# EasyEDA schematic SCH_Hacker-Card_2024-03-24.json
TITLE: Sheet_1; REV: 1.0; Date: 2024-03-18; Sheet: 1/1; Drawn By: swamstick; Company: Your Company
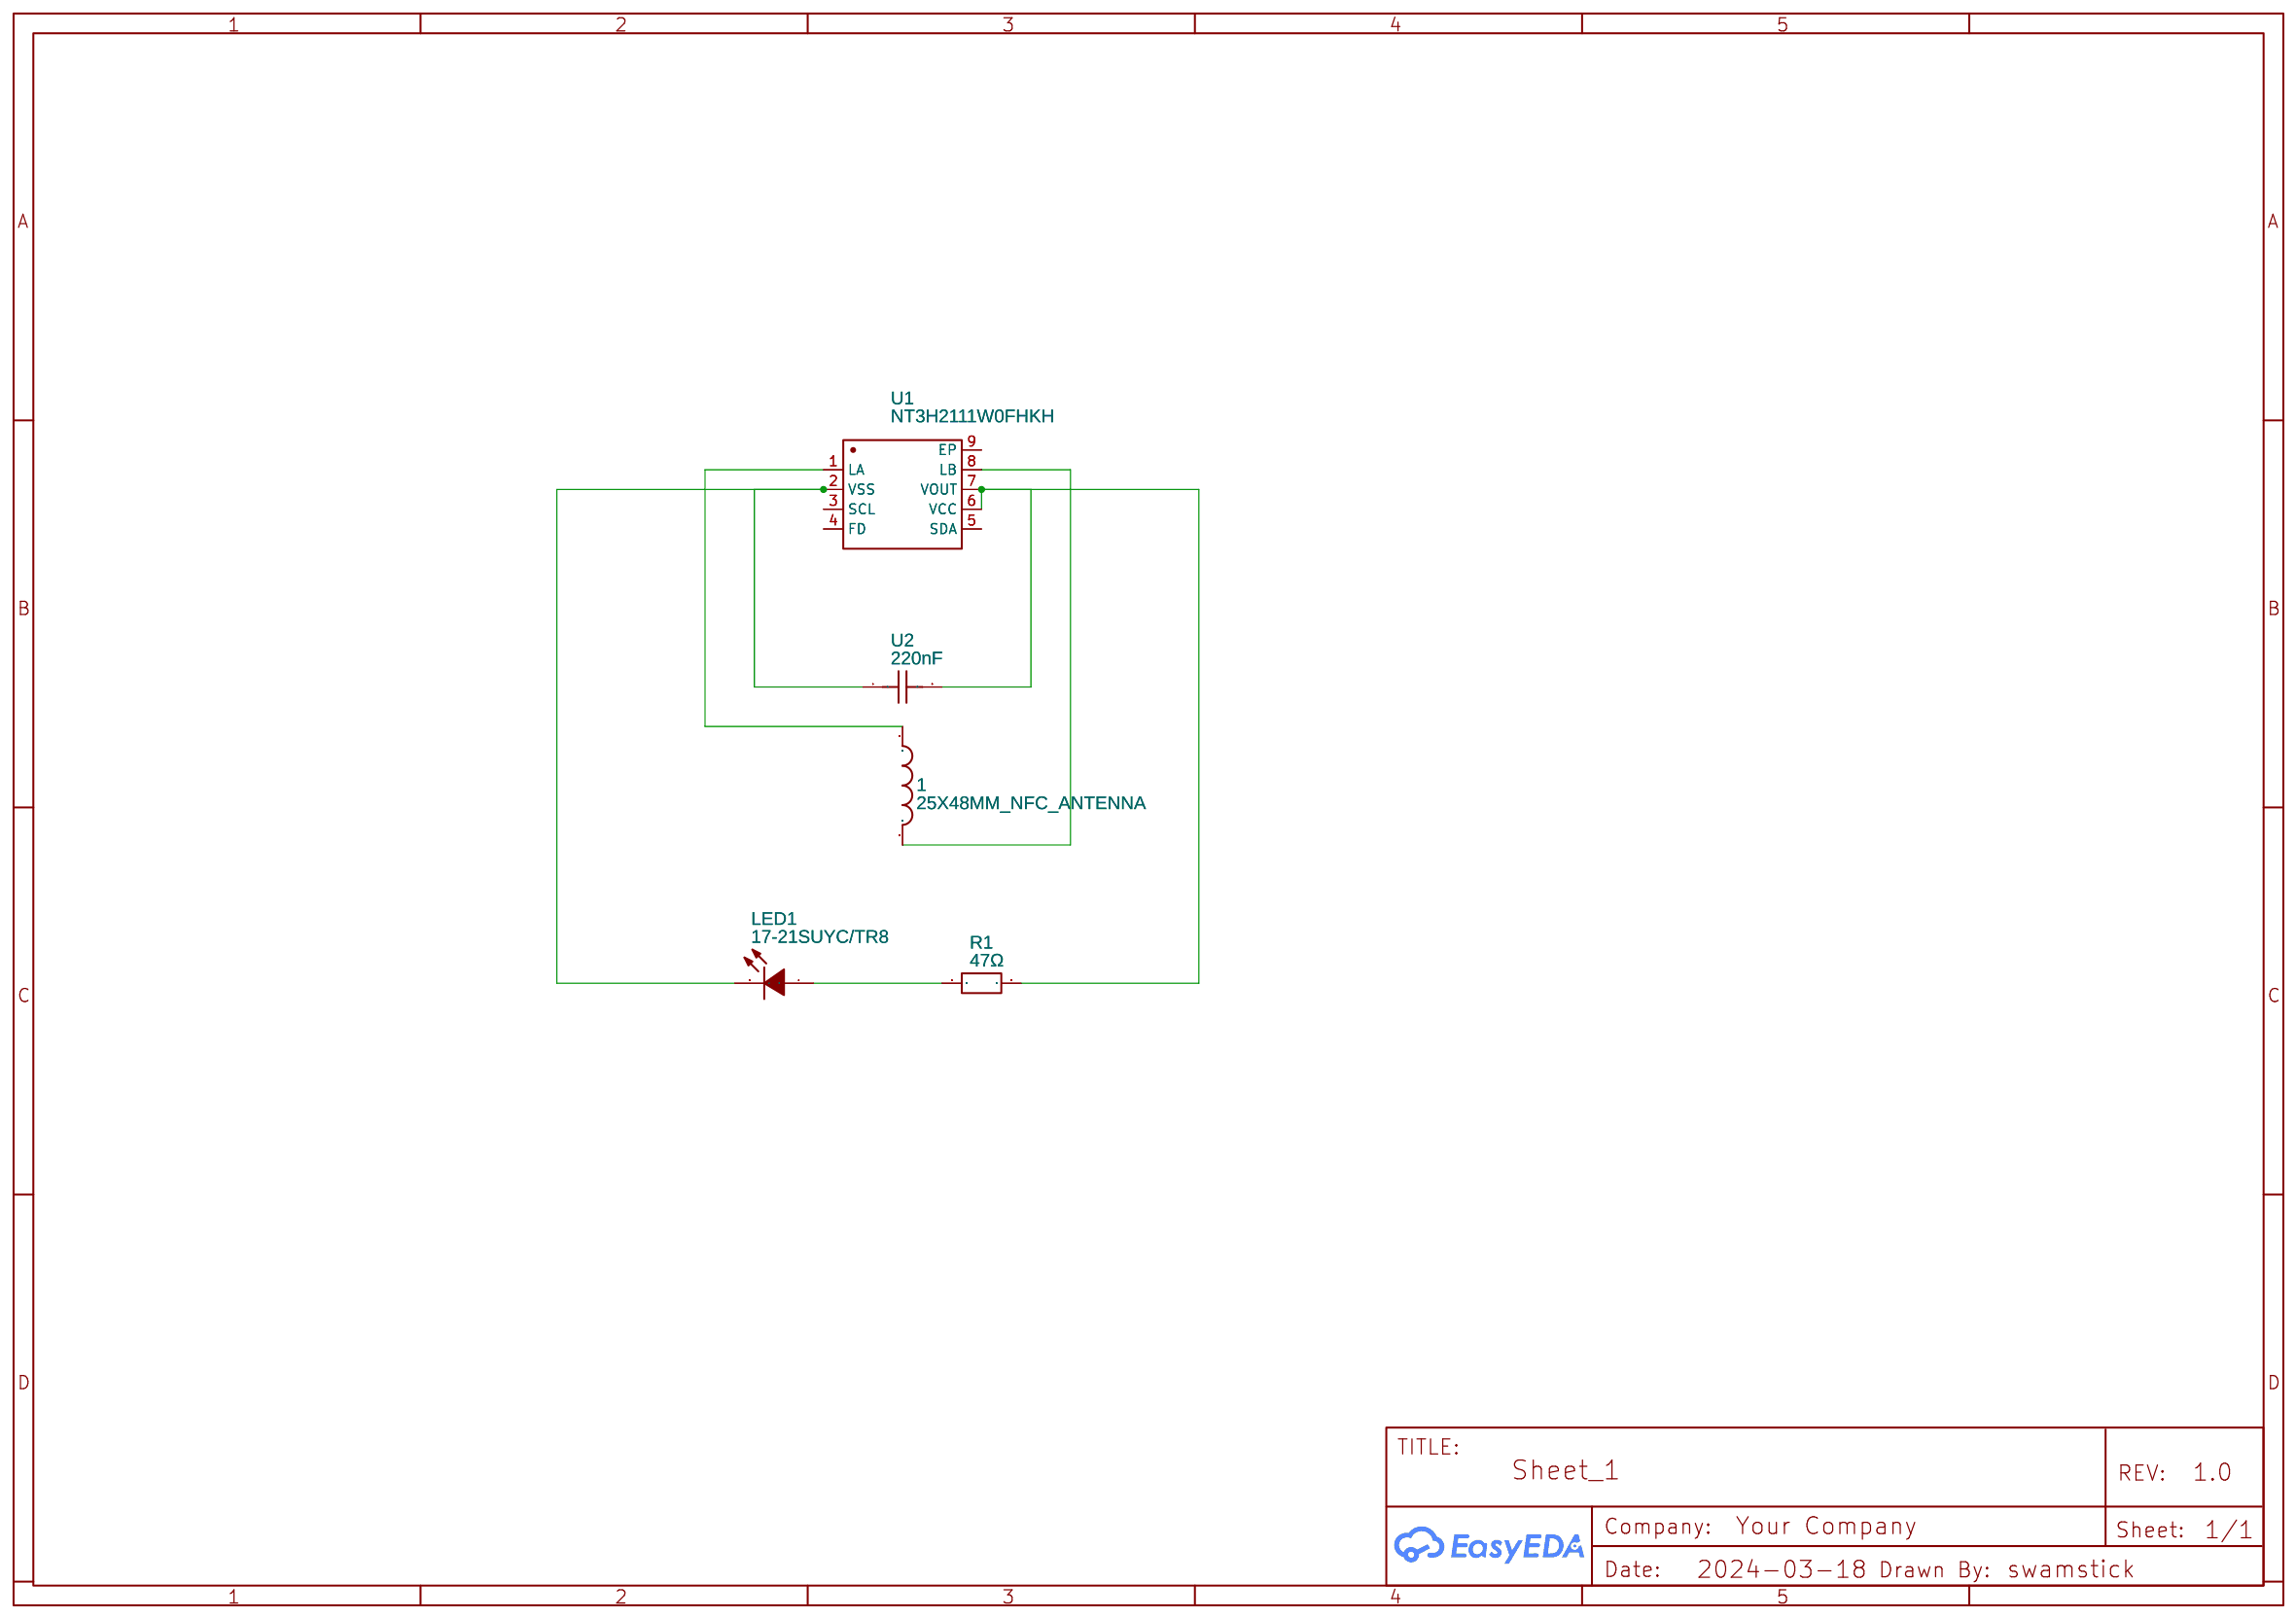
[diagram p0: schematic sheet]

## Parts
1  25X48MM_NFC_ANTENNA  [25X48MM_NFC_ANTENNA]
LED1  17-21SUYC/TR8  [LED0805-R-RD]
R1  47Ω  [R1206]
U1  NT3H2111W0FHKH  [XQFN-8_L1.6-W1.6-P0.50-BL]
U2  220nF  [C0402]

## Library data of the parts
1 = 25X48MM_NFC_ANTENNA: Contributor: Dan Schnur
LED1 = 17-21SUYC/TR8: Supplier: LCSC; Manufacturer: KENTO; Manufacturer Part: KT-0805黄灯; Supplier Part: C2296; JLCPCB Part Class: Basic Part
R1 = CRCW120647R0FKEA: Contributor: LCSC; Supplier: LCSC; Supplier Part: C844877; Manufacturer: VISHAY(威世); JLCPCB Part Class: Extended Part
U1 = NT3H2111W0FHKH: Contributor: LCSC; Supplier: LCSC; Supplier Part: C710403; Manufacturer: NXP(恩智浦); JLCPCB Part Class: Extended Part
U2 = UMK105BJ224KV-F: Contributor: lcsc; Supplier: LCSC; Supplier Part: C268018; Manufacturer: TAIYO YUDEN(太诱); JLCPCB Part Class: Extended Part

## Nets
Net-(1-P$1): 1.P$1 U1.1(LA)
Net-(1-P$2): 1.P$2 U1.8(LB)
Net-(LED1-1): LED1.1(+) R1.1
Net-(LED1-2): LED1.2(-) U1.2(VSS) U2.1
Net-(R1-2): R1.2 U1.6(VCC) U1.7(VOUT) U2.2

Not connected (* = marked no-connect by the designer): U1 3(SCL) 4(FD) 5(SDA) 9(EP)
